# EAGLE design iobbq_main (EAGLE 7.2.0)
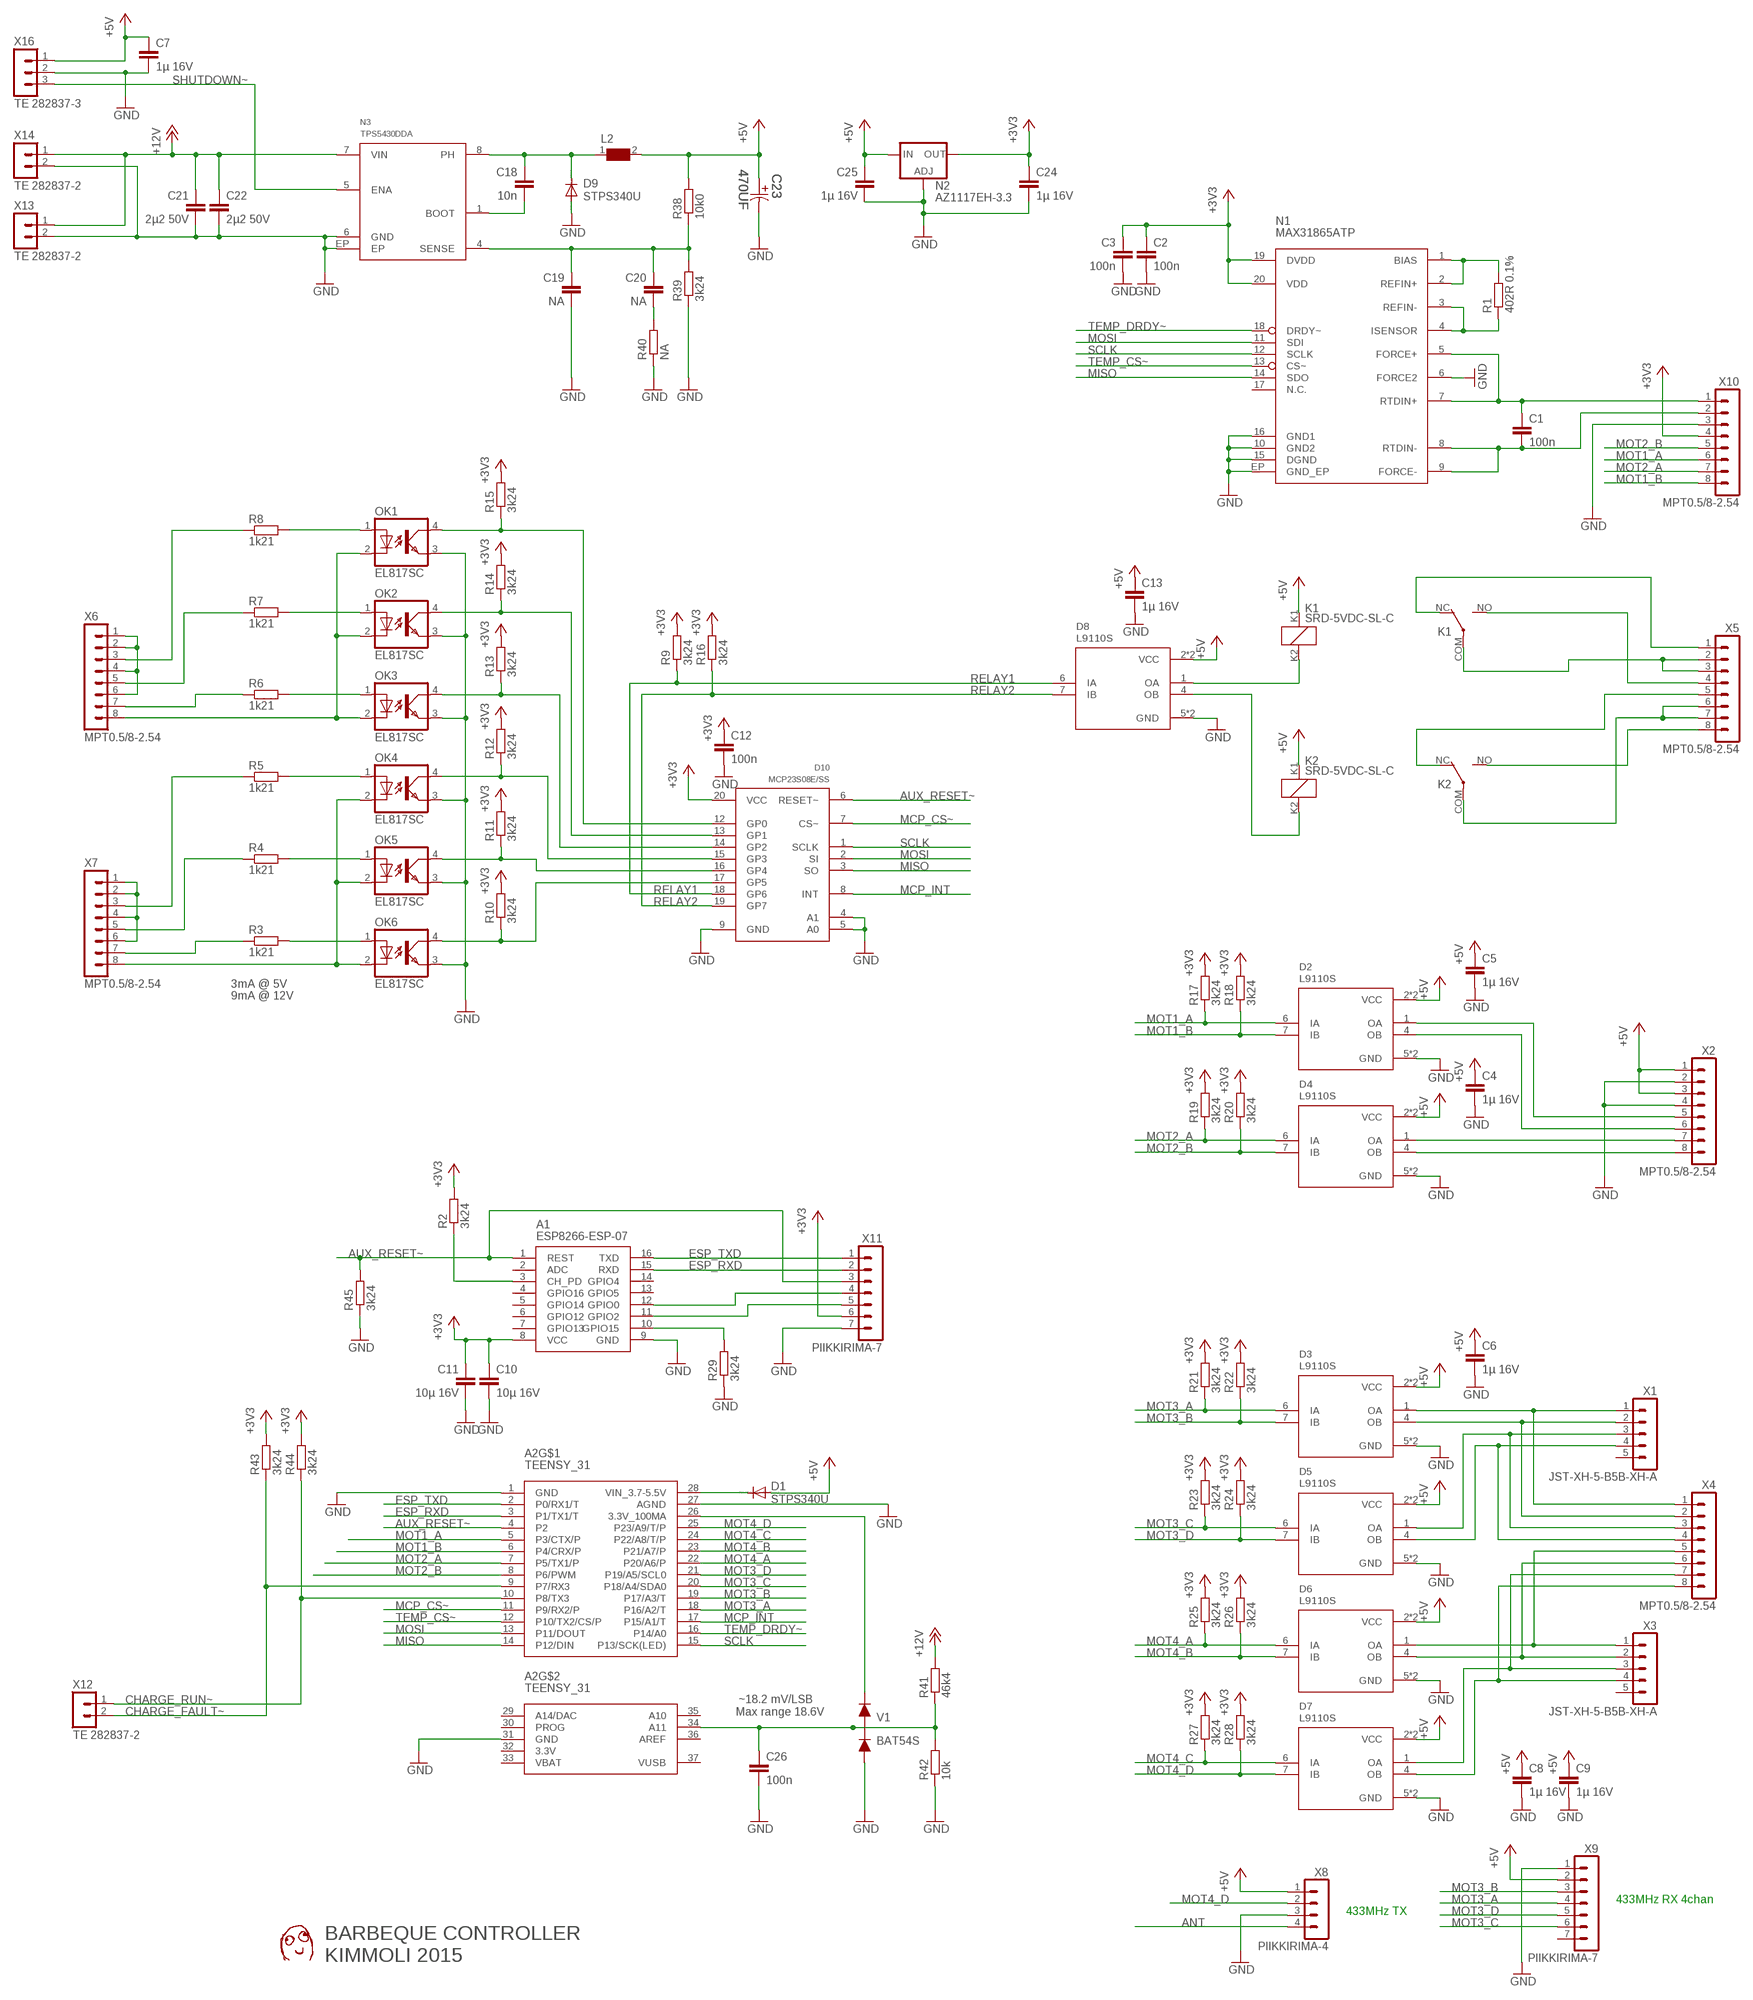
[diagram p0: schematic, sheet 1]

## Parts
A1  ESP8266-ESP-07  [ESP8266-ESP-07]
A2  TEENSY_31  [TEENSY_31_THONLY]
C1  100n  CAP0603  [C0603]
C2  100n  CAP0603  [C0603]
C3  100n  CAP0603  [C0603]
C4  1µ 16V  CAP0805  [C0805]
C5  1µ 16V  CAP0805  [C0805]
C6  1µ 16V  CAP0805  [C0805]
C7  1µ 16V  CAP0805  [C0805]
C8  1µ 16V  CAP0805  [C0805]
C9  1µ 16V  CAP0805  [C0805]
C10  10µ 16V  CAP0805  [C0805]
C11  10µ 16V  CAP0805  [C0805]
C12  100n  CAP0603  [C0603]
C13  1µ 16V  CAP0805  [C0805]
C18  10n  CAP0805  [C0805]
C19  NA  CAP0603  [C0603]
C20  NA  CAP0603  [C0603]
C21  2µ2 50V  CAP0805  [C0805]
C22  2µ2 50V  CAP0805  [C0805]
C23  470UF  EEV-FK1V471Q-CASE-H13  [CAPAE1350X1400N]
C24  1µ 16V  CAP0805  [C0805]
C25  1µ 16V  CAP0805  [C0805]
C26  100n  CAP0603  [C0603]
D1  STPS340U  DIODE-SMB  [SMB]
D2  L9110S  [SOIC8-N_MC]
D3  L9110S  [SOIC8-N_MC]
D4  L9110S  [SOIC8-N_MC]
D5  L9110S  [SOIC8-N_MC]
D6  L9110S  [SOIC8-N_MC]
D7  L9110S  [SOIC8-N_MC]
D8  L9110S  [SOIC8-N_MC]
D9  STPS340U  DIODE-SMB  [SMB]
D10  MCP23S08E/SS  [SSOP-20]
K1  SRD-5VDC-SL-C  [SRD-SL-C]
K2  SRD-5VDC-SL-C  [SRD-SL-C]
L2  WE-PD-7447709220_1260/1245/1280/1210  [WE-PD_1260/1245/1280/1210]
N1  MAX31865ATP  [TQFN-20]
N2  AZ1117EH-3.3  LD117AS33TR  [SOT223]
N3  TPS5430DDA  [SOIC8-N-EP]
OK1  EL817SC  SFH6186-2  [SMD4-7]
OK2  EL817SC  SFH6186-2  [SMD4-7]
OK3  EL817SC  SFH6186-2  [SMD4-7]
OK4  EL817SC  SFH6186-2  [SMD4-7]
OK5  EL817SC  SFH6186-2  [SMD4-7]
OK6  EL817SC  SFH6186-2  [SMD4-7]
R1  402R 0.1%  RES0603  [R0603]
R2  3k24  RES0603  [R0603]
R3  1k21  RES0805  [R0805]
R4  1k21  RES0805  [R0805]
R5  1k21  RES0805  [R0805]
R6  1k21  RES0805  [R0805]
R7  1k21  RES0805  [R0805]
R8  1k21  RES0805  [R0805]
R9  3k24  RES0603  [R0603]
R10  3k24  RES0603  [R0603]
R11  3k24  RES0603  [R0603]
R12  3k24  RES0603  [R0603]
R13  3k24  RES0603  [R0603]
R14  3k24  RES0603  [R0603]
R15  3k24  RES0603  [R0603]
R16  3k24  RES0603  [R0603]
R17  3k24  RES0603  [R0603]
R18  3k24  RES0603  [R0603]
R19  3k24  RES0603  [R0603]
R20  3k24  RES0603  [R0603]
R21  3k24  RES0603  [R0603]
R22  3k24  RES0603  [R0603]
R23  3k24  RES0603  [R0603]
R24  3k24  RES0603  [R0603]
R25  3k24  RES0603  [R0603]
R26  3k24  RES0603  [R0603]
R27  3k24  RES0603  [R0603]
R28  3k24  RES0603  [R0603]
R29  3k24  RES0603  [R0603]
R38  10k0  RES0603  [R0603]
R39  3k24  RES0603  [R0603]
R40  NA  RES0603  [R0603]
R41  46k4  RES0603  [R0603]
R42  10k  RES0603  [R0603]
R43  3k24  RES0603  [R0603]
R44  3k24  RES0603  [R0603]
R45  3k24  RES0603  [R0603]
U$3  DAFUG  [DAFUG]
V1  BAT54S  [SOT23]
X1  JST-XH-5-B5B-XH-A  [JST-XH-5]
X2  MPT0.5/8-2.54  [MPT0.5/8-2.54]
X3  JST-XH-5-B5B-XH-A  [JST-XH-5]
X4  MPT0.5/8-2.54  [MPT0.5/8-2.54]
X5  MPT0.5/8-2.54  [MPT0.5/8-2.54]
X6  MPT0.5/8-2.54  [MPT0.5/8-2.54]
X7  MPT0.5/8-2.54  [MPT0.5/8-2.54]
X8  PIIKKIRIMA-4  [PIIKKIRIMA-4]
X9  PIIKKIRIMA-7  [PIIKKIRIMA-7]
X10  MPT0.5/8-2.54  [MPT0.5/8-2.54]
X11  PIIKKIRIMA-7  [PIIKKIRIMA-7]
X12  TE 282837-2  TE_RUUVILIITIN2  [TE_RUUVILIITIN2]
X13  TE 282837-2  TE_RUUVILIITIN2  [TE_RUUVILIITIN2]
X14  TE 282837-2  TE_RUUVILIITIN2  [TE_RUUVILIITIN2]
X16  TE 282837-3  TE_RUUVILIITIN3  [TE_RUUVILIITIN3]

## Nets
+3V3: A1.8(VCC) C2.1 C3.1 C10.1 C11.1 C12.1 C24.1 D10.20(VCC) N1.19(DVDD) N1.20(VDD) N2.4(OUT) R2.2 R9.2 R10.2 R11.2 R12.2 R13.2 R14.2 R15.2 R16.2 R17.2 R18.2 R19.2 R20.2 R21.2 R22.2 R23.2 R24.2 R25.2 R26.2 R27.2 R28.2 R43.2 R44.2 X10.4 X11.6
+5V: C4.1 C5.1 C6.1 C7.1 C8.1 C9.1 C13.1 C23.1 C25.1 D1.A D2.2(VCC) D2.3(VCC) D3.2(VCC) D3.3(VCC) D4.2(VCC) D4.3(VCC) D5.2(VCC) D5.3(VCC) D6.2(VCC) D6.3(VCC) D7.2(VCC) D7.3(VCC) D8.2(VCC) D8.3(VCC) K1.K1 K2.K1 L2.2 N2.3(IN) R38.2 X2.1 X2.3 X8.1 X9.2 X16.1
+12V: C21.1 C22.1 N3.7(VIN) R41.2 X13.1 X14.1
ANT: X8.4
AUX_RESET~: A1.1(REST) A2.4(P2) D10.6(RESET~) R45.2 X11.3
CHARGE_FAULT~: A2.9(P7/RX3) R43.1 X12.2
CHARGE_RUN~: A2.10(P8/TX3) R44.1 X12.1
ESP_RXD: A1.15(RXD) A2.3(P1/TX1/T) X11.2
ESP_TXD: A1.16(TXD) A2.2(P0/RX1/T) X11.1
GND: A1.9(GND) A2.1(GND) A2.27(AGND) A2.31(GND) C2.2 C3.2 C4.2 C5.2 C6.2 C7.2 C8.2 C9.2 C10.2 C11.2 C12.2 C13.2 C19.2 C21.2 C22.2 C23.2 C24.2 C25.2 C26.2 D2.5(GND) D2.8(GND) D3.5(GND) D3.8(GND) D4.5(GND) D4.8(GND) D5.5(GND) D5.8(GND) D6.5(GND) D6.8(GND) D7.5(GND) D7.8(GND) D8.5(GND) D8.8(GND) D9.A D10.4(A1) D10.5(A0) D10.9(GND) N1.6(FORCE2) N1.10(GND2) N1.15(DGND) N1.16(GND1) N1.EP(GND_EP) N2.1(ADJ) N3.6(GND) N3.EP OK1.3(EMIT) OK2.3(EMIT) OK3.3(EMIT) OK4.3(EMIT) OK5.3(EMIT) OK6.3(EMIT) R29.1 R39.1 R40.1 R42.1 R45.1 V1.1 X2.2 X2.4 X8.3 X9.1 X10.3 X11.7 X13.2 X14.2 X16.2
MCP_CS~: A2.11(P9/RX2/P) D10.7(CS~)
MCP_INT: A2.17(P15/A1/T) D10.8(INT)
MISO: A2.14(P12/DIN) D10.3(SO) N1.14(SDO)
MOSI: A2.13(P11/DOUT) D10.2(SI) N1.11(SDI)
MOT1_A: A2.5(P3/CTX/P) D2.6(IA) R17.1 X10.6
MOT1_B: A2.6(P4/CRX/P) D2.7(IB) R18.1 X10.8
MOT2_A: A2.7(P5/TX1/P) D4.6(IA) R19.1 X10.7
MOT2_B: A2.8(P6/PWM) D4.7(IB) R20.1 X10.5
MOT3_A: A2.18(P16/A2/T) D3.6(IA) R21.1 X9.4
MOT3_B: A2.19(P17/A3/T) D3.7(IB) R22.1 X9.3
MOT3_C: A2.20(P18/A4/SDA0) D5.6(IA) R23.1 X9.6
MOT3_D: A2.21(P19/A5/SCL0) D5.7(IB) R24.1 X9.5
MOT4_A: A2.22(P20/A6/P) D6.6(IA) R25.1
MOT4_B: A2.23(P21/A7/P) D6.7(IB) R26.1
MOT4_C: A2.24(P22/A8/T/P) D7.6(IA) R27.1
MOT4_D: A2.25(P23/A9/T/P) D7.7(IB) R28.1 X8.2
N$1: OK1.2(C) OK2.2(C) OK3.2(C) X6.8
N$2: C1.2 N1.8(RTDIN-) N1.9(FORCE-) X10.2
N$3: D3.1(OA) X1.1 X4.1
N$4: D3.4(OB) X1.2 X4.2
N$5: D5.1(OA) X1.3 X4.3
N$6: D5.4(OB) X1.4 X4.4
N$7: D6.1(OA) X3.1 X4.5
N$8: R6.1 X6.7
N$9: D4.4(OB) X2.8
N$10: D6.4(OB) X3.2 X4.6
N$11: D4.1(OA) X2.7
N$12: D2.4(OB) X2.6
N$13: D2.1(OA) X2.5
N$14: D7.1(OA) X3.3 X4.7
N$15: D7.4(OB) X3.4 X4.8
N$16: D8.4(OB) K2.K2
N$17: A1.10(GPIO15) R29.2
N$18: D8.1(OA) K1.K2
N$24: OK4.2(C) OK5.2(C) OK6.2(C) X7.8
N$25: A1.3(CH_PD) R2.1
N$26: D10.17(GP5) OK6.4(COL) R10.1
N$27: D10.16(GP4) OK5.4(COL) R11.1
N$28: C1.1 N1.5(FORCE+) N1.7(RTDIN+) X10.1
N$29: D10.15(GP3) OK4.4(COL) R12.1
N$30: N1.3(REFIN-) N1.4(ISENSOR) R1.1
N$31: N1.1(BIAS) N1.2(REFIN+) R1.2
N$32: D10.14(GP2) OK3.4(COL) R13.1
N$33: D10.13(GP1) OK2.4(COL) R14.1
N$34: D10.12(GP0) OK1.4(COL) R15.1
N$35: R7.1 X6.5
N$36: OK1.1(A) R8.2
N$37: OK2.1(A) R7.2
N$38: OK3.1(A) R6.2
N$39: OK4.1(A) R5.2
N$40: OK5.1(A) R4.2
N$41: OK6.1(A) R3.2
N$42: R8.1 X6.3
N$43: C18.1 D9.C L2.1 N3.8(PH)
N$44: R3.1 X7.7
N$45: R4.1 X7.5
N$46: X6.1 X6.2 X6.4 X6.6
N$47: R5.1 X7.3
N$48: X7.1 X7.2 X7.4 X7.6
N$50: A2.28(VIN_3.7-5.5V) D1.C
N$55: A1.12(GPIO0) X11.4
N$56: A1.11(GPIO2) X11.5
N$58: C18.2 N3.1(BOOT)
N$60: C19.1 C20.1 N3.4(SENSE) R38.1 R39.2
N$62: C20.2 R40.2
N$72: A2.34(A11) C26.1 R41.1 R42.2 V1.3
N$73: A2.26(3.3V_100MA) V1.2
RELAY1: D8.6(IA) D10.18(GP6) R9.1
RELAY2: D8.7(IB) D10.19(GP7) R16.1
RLY1COM [rele]: K1.COM(P) X5.2 X5.3
RLY1NC [rele]: K1.NC(O) X5.1
RLY1NO [rele]: K1.NO(S) X5.4
RLY2COM [rele]: K2.COM(P) X5.6 X5.7
RLY2NC [rele]: K2.NC(O) X5.5
RLY2NO [rele]: K2.NO(S) X5.8
SCLK: A2.15(P13/SCK(LED)) D10.1(SCLK) N1.12(SCLK)
SHUTDOWN~: N3.5(ENA) X16.3
TEMP_CS~: A2.12(P10/TX2/CS/P) N1.13(CS~)
TEMP_DRDY~: A2.16(P14/A0) N1.18(DRDY~)
Unconnected: A1.2(ADC) A1.4(GPIO16) A1.5(GPIO14) A1.6(GPIO12) A1.7(GPIO13) A1.13(GPIO5) A1.14(GPIO4) A2.29(A14/DAC) A2.30(PROG) A2.32(3.3V) A2.33(VBAT) A2.35(A10) A2.36(AREF) A2.37(VUSB) N1.17(N.C.) X1.5 X3.5 X9.7

## Notes on the sheet
- 3mA @ 5V
- 9mA @ 12V
- ~18.2 mV/LSB
  Max range 18.6V
- 433MHz RX 4chan
- 433MHz TX
- BARBEQUE CONTROLLER
  KIMMOLI 2015

## Library data of the parts
A1 = OMAT_IC:ESP8266-ESP-07
A2 = OMAT_IC:TEENSY_31
C1-C13 C18-C22 C24-C26 = OMAT_IC:CAP
C23 = EKE:EEV-: Aluminum Electrolytic Capacitors,Surface Mount Type; MPN: EEVFK1V471Q; OC_FARNELL: 2282105; OC_NEWARK: 53W3911; SUPPLIER: PANASONIC; TOLERANCE: ±20 %; VOLTAGERATING: 35V
D1 D9 = diode:DIODE-: DIODE
D2-D8 = OMAT_IC:L9110S
D10 = OMAT_IC:MCP23S08
K1 K2 = OMAT_IC:SRD-5VDC-SL-C
L2 = WE-PD:WE-PD: SMD-Shielded Power Inductors WE-PD - Magnetically shielded version which results in a low leakage field - High storage capacity - Low self-losses - Highest possible current loading for SMD-Inducors -- Switching regulators with low operating voltages (computer, laptop, mobile phones, pagers) -- Integrated DC/DC-converter -- Is recommended for the application with switching regulators from National Semiconductor, Linear Technology, Texas Instruments and Fairchild Semiconductor, ect. -- Graphic cards -- Plastic base: Because of the one piece construction these are more suitable for high vibration or shock applications; MPN: 7447709220; OC_FARNELL: 1635945; OC_NEWARK: 08P2775; PACKAGE: 1210; SUPPLIER: Wuerth Elektronik
N1 = OMAT_IC:MAX31865
N2 = EKE:LD117A?*: Low drop fixed and adjustable positive voltage regulators 1 A Source: http://www.st.com/stonline/products/literature/ds/7194/ld1117axx.pdf
N3 = OMAT_IC:TPS5430
OK1-OK6 = optocoupler:SFH618?*: Optocoupler, Phototransistor Output, Low Input Current Source: Data sheet <http://www.vishay.com/docs/83673/sfh618.pdf>; MF: VISHAY/TELEFUNKEN; MPN: SFH6186-2; OC_FARNELL: 1469583; OC_NEWARK: 58K2210
R1-R29 R38-R45 = OMAT_IC:RES
U$3 = dafug:DAFUG
V1 = OMAT_IC:BAT54S
X1 X3 = OMAT_IC:JST-XH-5
X2 X4-X7 X10 = OMAT_IC:MPT0.5/8-2.54
X8 = OMAT_IC:PIIKKIRIMA-4
X9 X11 = OMAT_IC:PIIKKIRIMA-7
X12-X14 = OMAT_IC:TE_RUUVILIITIN2
X16 = OMAT_IC:TE_RUUVILIITIN3

## Net classes
1 rele: clearance 3 mm to class 0

## Board
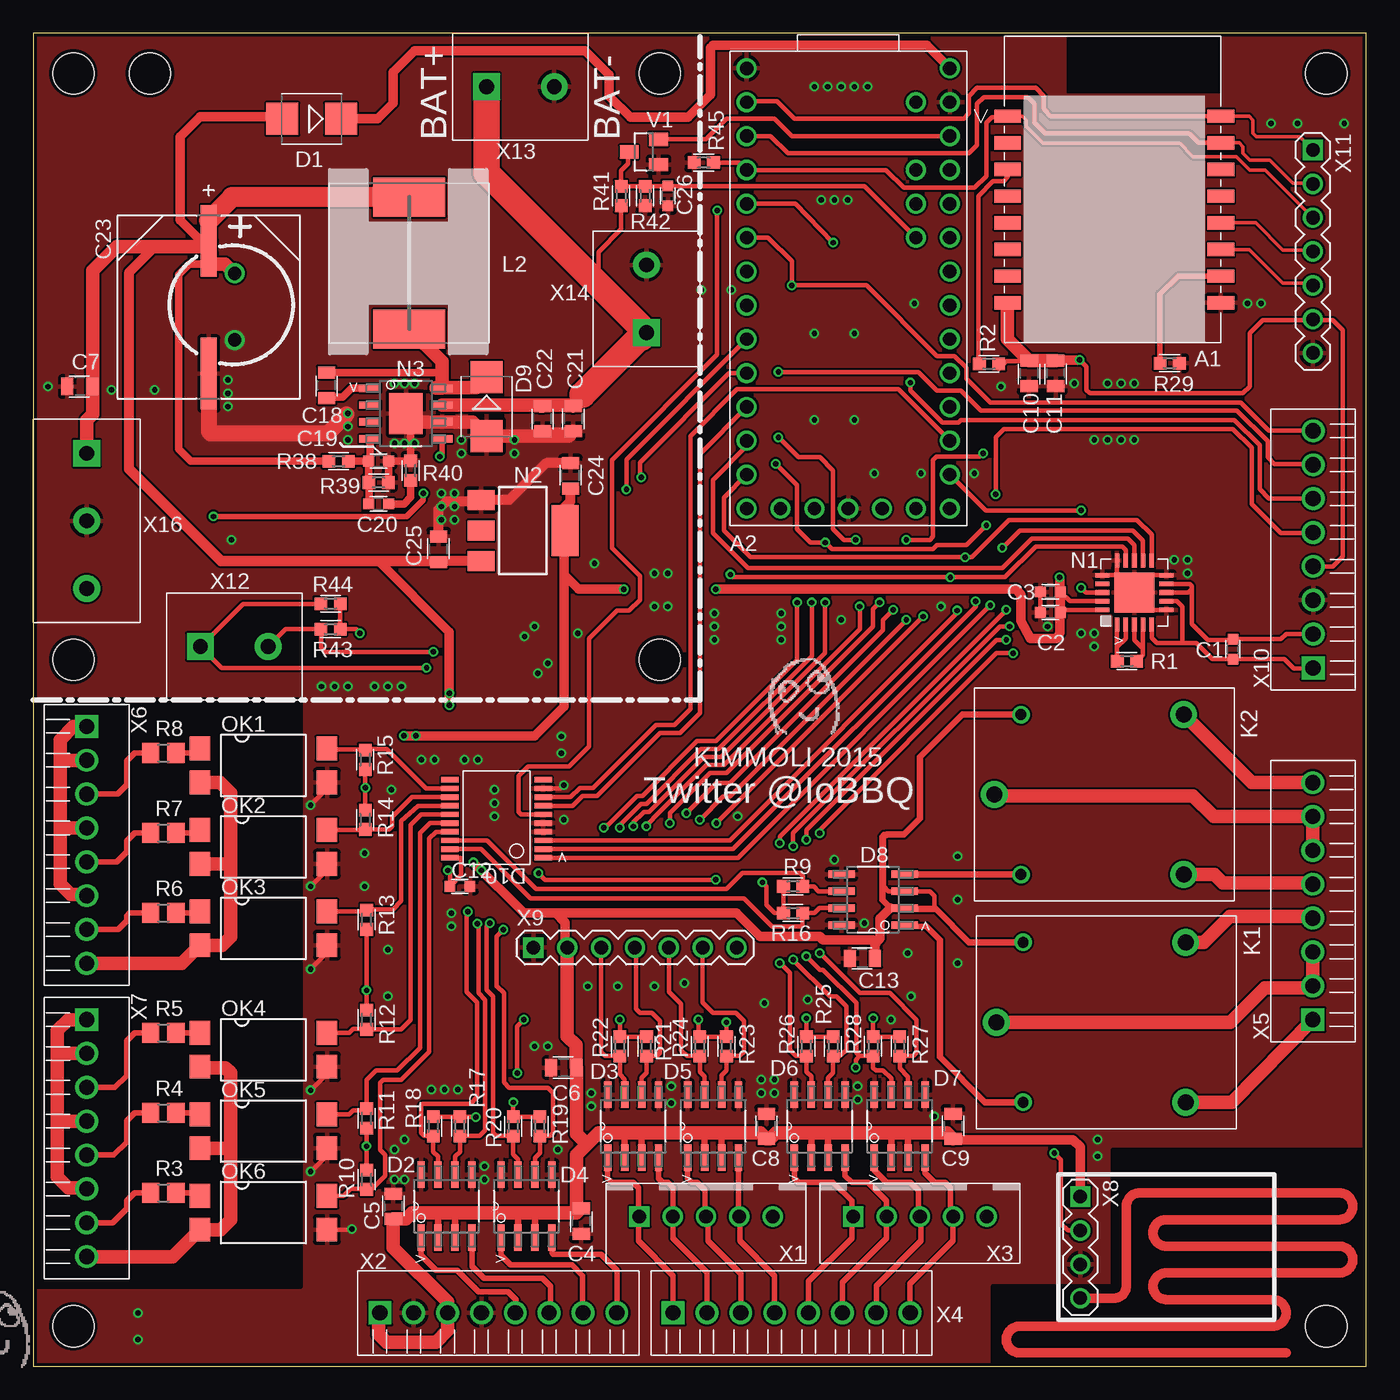
[diagram p1: board, top side]
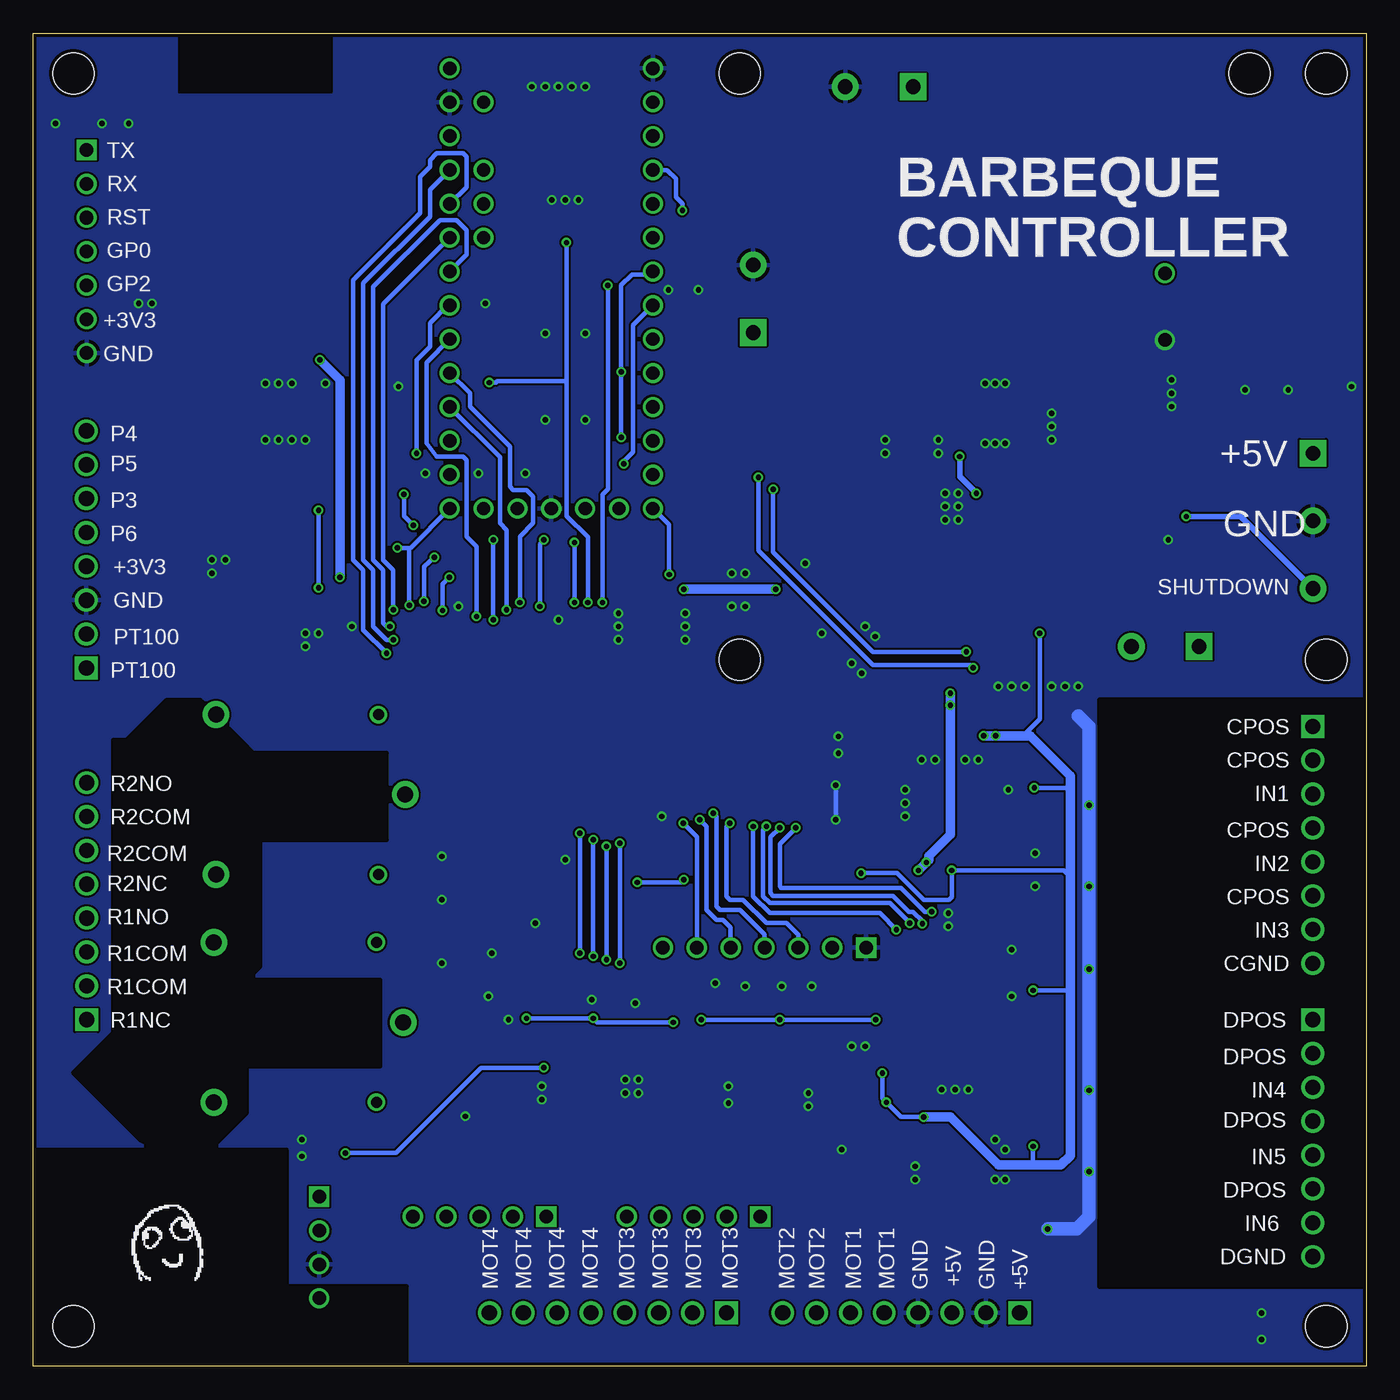
[diagram p2: board, bottom side, seen from below]

Size 100 x 100 mm. Coordinates in mm from the lower left corner, seen from the top.
Outline: 0,0 100,0 100,100 0,100 0,0
Copper layers (1*16): Top 0.035mm / dielectric 1.5mm / Bottom 0.035mm
Design rules "ITEADstudio_DRC": minimum track width 6mil, minimum drill 12mil, track to track 6mil, track to pad 6mil, pad to pad 6mil, via to via 6mil, smd to smd 0mil, copper to edge 10mil, drill to drill 10mil, minimum pad ring 10mil, minimum via ring 6mil, stop-mask expansion 2mil, vias tented up to drill 100mil, thermal gap 10mil
Holes 3.1 mm at 3,3 3,97 47,97 3,53 47,53 97,3 97,97 8.75,97
tRestrict: area 0,6 to 20,50; area 72,0 to 100,16.2
bRestrict: area 0,6 to 20,50; area 73.5,16.5 to 97,50; area 72,0 to 100,16.2

### Footprints (pad centres in the part's own frame; a part is rotated, then mirrored left to right if it is on the bottom)
ESP8266-ESP-07 = smd 2 x 1: 1 -8,0; 2 -8,-2; 3 -8,-4; 4 -8,-6; 5 -8,-8; 6 -8,-10; 7 -8,-12; 8 -8,-14; 9 8,-14; 10 8,-12; 11 8,-10; 12 8,-8; 13 8,-6; 14 8,-4; 15 8,-2; 16 8,0
TEENSY_31_THONLY = drill 1: 1 0,0; 2 0,-2.54; 3 0,-5.08; 4 0,-7.62; 5 0,-10.16; 6 0,-12.7; 7 0,-15.24; 8 0,-17.78; 9 0,-20.32; 10 0,-22.86; 11 0,-25.4; 12 0,-27.94; 13 0,-30.48; 14 0,-33.02; 15 15.24,-33.02; 16 15.24,-30.48; 17 15.24,-27.94; 18 15.24,-25.4; 19 15.24,-22.86; 20 15.24,-20.32; 21 15.24,-17.78; 22 15.24,-15.24; 23 15.24,-12.7; 24 15.24,-10.16; 25 15.24,-7.62; 26 15.24,-5.08; 27 15.24,-2.54; 28 15.24,0; 29 12.7,-33.02; 30 10.16,-33.02; 31 7.62,-33.02; 32 5.08,-33.02; 33 2.54,-33.02; 34 12.7,-12.7; 35 12.7,-10.16; 36 12.7,-7.62; 37 12.7,-2.54
C0603 = smd 0.8 x 0.8: 1 -0.75,0; 2 0.75,0
C0805 = smd 0.9 x 1.3: 1 -0.95,0; 2 0.95,0
CAPAE1350X1400N = smd 5.359 x 1.194: 1 -4.978,0; 2 4.978,0
SMB = smd 2.4 x 2.4: A 2.2,0; C -2.2,0
SOIC8-N_MC = smd 1.981 x 0.559: 1 -2.362,1.905; 2 -2.362,0.635; 3 -2.362,-0.635; 4 -2.362,-1.905; 5 2.362,-1.905; 6 2.362,-0.635; 7 2.362,0.635; 8 2.362,1.905
SSOP-20 = smd 1.3 x 0.4: 1 -3.5,0; 2 -3.5,-0.65; 3 -3.5,-1.3; 4 -3.5,-1.95; 5 -3.5,-2.6; 6 -3.5,-3.25; 7 -3.5,-3.9; 8 -3.5,-4.55; 9 -3.5,-5.2; 10 -3.5,-5.85; 11 3.5,-5.85; 12 3.5,-5.2; 13 3.5,-4.55; 14 3.5,-3.9; 15 3.5,-3.25; 16 3.5,-2.6; 17 3.5,-1.95; 18 3.5,-1.3; 19 3.5,-0.65; 20 3.5,0
SRD-SL-C = drill 1.2 pad 2: COM 0,0; NC 14.2,-6; NO 14.2,6 | drill 0.8: K1 2,6; K2 2,-6
WE-PD_1260/1245/1280/1210 = smd 2.9 x 5.4: 1 -4.95,0; 2 4.95,0
TQFN-20 = smd 1.05 x 0.35: 1 -2.39,1.3; 2 -2.39,0.65; 3 -2.39,0; 4 -2.39,-0.65; 5 -2.39,-1.3; 11 2.39,-1.3; 12 2.39,-0.65; 13 2.39,0; 14 2.39,0.65; 15 2.39,1.3 | smd 0.35 x 1.05: 6 -1.3,-2.39; 7 -0.65,-2.39; 8 0,-2.39; 9 0.65,-2.39; 10 1.3,-2.39; 16 1.3,2.39; 17 0.65,2.39; 18 0,2.39; 19 -0.65,2.39; 20 -1.3,2.39 | smd 3 x 3: EP 0,0
SOT223 = smd 1.5 x 2: 1 -2.3,-3.15; 2 0,-3.15; 3 2.3,-3.15 | smd 3.8 x 2: 4 0,3.15
SOIC8-N-EP = smd 1.6 x 0.559: 1 -2.7,1.905; 2 -2.7,0.635; 3 -2.7,-0.635; 4 -2.7,-1.905; 5 2.7,-1.905; 6 2.7,-0.635; 7 2.7,0.635; 8 2.7,1.905 | smd 2.5 x 3.1: EP 0,0
SMD4-7 = smd 1.78 x 1.55: 1 -1.27,-4.77; 2 1.27,-4.77; 3 1.27,4.77; 4 -1.27,4.77
R0603 = smd 0.95 x 0.95: 1 -0.725,0; 2 0.725,0
R0805 = smd 1.3 x 1.5: 1 -0.95,0; 2 0.95,0
SOT23 = smd 1 x 1.4: 1 -0.95,-1.1; 2 0.95,-1.1; 3 0,1.1
JST-XH-5 = drill 1.016 square: 1 10,0 | drill 1.016: 2 7.5,0; 3 5,0; 4 2.5,0; 5 0,0
MPT0.5/8-2.54 = drill 1.143 square: 1 0,0 | drill 1.143: 2 2.54,0; 3 5.08,0; 4 7.62,0; 5 10.16,0; 6 12.7,0; 7 15.24,0; 8 17.78,0
PIIKKIRIMA-4 = drill 1.016 square: 1 0,0 | drill 1.016: 2 2.54,0; 3 5.08,0; 4 7.62,0
PIIKKIRIMA-7 = drill 1.016 square: 1 0,0 | drill 1.016: 2 2.54,0; 3 5.08,0; 4 7.62,0; 5 10.16,0; 6 12.7,0; 7 15.24,0
TE_RUUVILIITIN2 = drill 1.1 pad 2 square: 1 0,0 | drill 1.1 pad 2: 2 5.08,0
TE_RUUVILIITIN3 = drill 1.1 pad 2 square: 1 0,0 | drill 1.1 pad 2: 2 5.08,0; 3 10.16,0

### Placement (x,y rotation side)
A1  81.09,93.78 0 top
A2  53.52,97.37 0 top
C1  90,53.8 90 top
C2  76.3,56.55 180 top
C3  76.3,58.1 180 top
C4  41.1,10.9 270 top
C5  27,12 90 top
C6  39.8,22.4 180 top
C7  3.5,73.5 180 top
C8  55,18 90 top
C9  69,18 90 top
C10  74.7,74.5 270 top
C11  76.7,74.5 270 top
C12  32,36 0 top
C13  62.2,30.6 180 top
C18  22,73.6 270 top
C19  25.9,67.9 0 top
C20  25.9,64.7 0 top
C21  40.5,71.1 270 top
C22  38.2,71.1 270 top
C23  13.16,79.46 270 top
C24  40.3,66.8 90 top
C25  30.4,61.3 90 top
C26  47.6,87.8 270 top
D1  20.88,93.58 180 top
D2  31,12 90 top
D3  45,18 90 top
D4  37,12 90 top
D5  51,18 90 top
D6  59,18 90 top
D7  65,18 90 top
D8  63,35 180 top
D9  34,72 270 top
D10  34.75,38.15 180 top
K1  72.25,25.8 0 top
K2  72.1,42.89 0 top
L2  28.2,82.76 90 top
N1  82.6,58.05 90 top
N2  36.74,62.69 270 top
N3  27.95,71.47 0 top
OK1  17.26,45.07 270 top
OK2  17.26,38.96 270 top
OK3  17.26,32.85 270 top
OK4  17.26,23.74 270 top
OK5  17.26,17.63 270 top
OK6  17.26,11.52 270 top
R1  82.05,52.9 180 top
R2  71.7,75.2 0 top
R3  9.75,13 0 top
R4  9.75,19 0 top
R5  9.75,25 0 top
R6  9.75,34 0 top
R7  9.75,40 0 top
R8  9.75,46 0 top
R9  57,36 180 top
R10  25,14 90 top
R11  25,18.6 270 top
R12  25,26 90 top
R13  25,33.5 270 top
R14  24.9,41 90 top
R15  24.9,45.5 270 top
R16  57,34 180 top
R17  32,18 90 top
R18  30,18 90 top
R19  38,18 90 top
R20  36,18 90 top
R21  46,24 90 top
R22  44,24 90 top
R23  52,24 90 top
R24  50,24 90 top
R25  60,24 90 top
R26  58,24 90 top
R27  65,24 90 top
R28  63,24 90 top
R29  85.25,75.25 180 top
R38  22.9,67.9 180 top
R39  25.9,66.3 180 top
R40  28.3,67.2 270 top
R41  44.1,87.8 270 top
R42  45.9,87.8 90 top
R43  22.3,55.3 0 top
R44  22.3,57.2 0 top
R45  50.3,90.3 0 top
U$1  [DAFUG]  89.75,9 0 bottom
U$2  [DAFUG]  58,50 0 top
U$3  -2.75,2.5 0 top
V1  45.8,91.1 90 top
X1  55.47,11.23 180 top
X2  26,4 0 top
X3  71.52,11.23 180 top
X4  48,4 0 top
X5  96,26 90 top
X6  4,48 270 top
X7  4,26 270 top
X8  78.55,12.72 270 top
X9  37.52,31.41 0 top
X10  96.02,52.39 90 top
X11  96,91.25 270 top
X12  12.54,54 0 top
X13  34,96 0 top
X14  46,77.54 90 top
X16  4,68.5 270 top

### Tracks (layer width: path | path; a pad name or v marks a point on that pad's centre or on a via)
+3V3  (via drill 0.4)
  Top 0.25: 95.95,78.5 X11.6
  Top 0.35: N1.20 77.25,56.75 C2.1 | N1.19 77.75,57.4 C3.1 | R44.2 R43.2 24.2,55.3 v24.5,55 | 39.8,62.6 N2.4 | R10.2 v25,16.5 R11.2 | R12.2 v25,28.2 R13.2 | R15.2 v24.9,43.4 R14.2 | v31.1,37.2 31.25,37.05 C12.1 32.1,36.85 32.1,38.1 32.05,38.15 D10.20 | v44,26 R22.2 R21.2 | v49.9,26 49.9,24.82 R24.2 R23.2 v52,25.8 | R9.2 R16.2 55.6,34 55,34.6 55,36 v54.7,36.3 | R25.2 R26.2 v58,26.1 | R27.2 R28.2 v63,26.1 | R2.2 72.42,74.83 73,75.4 74.65,75.4 C10.1 | R18.2 R17.2 33.17,18.73 v33.2,18.7 | v36,19.8 R20.2 R19.2 | v36.8,26 36.3,25.5 v36.3,22 | v51.2,36.5 38.4,36.5 v37.9,37 | v78.5,75.5 79,75 79,73.25 79.25,73 90.75,73 91.25,73.5 91.25,77.5 92.25,78.5 95.95,78.5 | X10.4 97.51,60.01 98.25,60.75 98.25,77.75 97.5,78.5 96.05,78.5 X11.6
  Top 0.7: 39.8,62.6 39.8,59.4 | 39.8,59.4 39.8,49.5 37.6,47.3 v27.8,47.3 | v51.2,58.3 73.7,58.3 74.1,57.9 74.1,55.9 74.8,54.6 76.8,54.6 77,55 77,56.5 C2.1 C3.1 77,58.15 v77,59.2 | v44.3,58.3 40.9,58.3 39.8,59.4 | v78.5,75.5 76.75,75.5 C11.1
  Top 0.75: N2.4 39.89,64.49 40.3,64.9 C24.1
  Top 1: A1.8 73.09,77.06 C10.1 C11.1
  Bottom 0.35: v25,16.5 25,15.3 24.8,15.1 | v25,28.2 22.3,28.2 22.2,28.1 | v24.9,43.4 22.3,43.4 22.2,43.3 | 22.2,36.7 22.7,37.2 v31.1,37.2 31.1,35.2 31.3,35 33.2,35 35.2,37 v37.9,37 | v49.9,26 v44,26 v36.8,26 | v63,26.1 v58,26.1 57.7,25.8 v52,25.8 | v24.5,55 24.5,48.55 25.75,47.3 | v33.2,18.7 34.9,18.7 v36,19.8 36.3,20.1 v36.3,22 | v54.7,36.3 51.4,36.3 v51.2,36.5
  Bottom 0.7: v33.2,18.7 31.2,18.7 27.6,15.1 24.8,15.1 22.9,15.1 22.2,15.8 22.2,28.1 22.2,36.7 22.2,43.3 22.2,44.3 25.2,47.3 25.75,47.3 v27.8,47.3 v28.7,47.3 | v51.2,58.3 v44.3,58.3 | v77,59.2 77,74 v78.5,75.5
+5V  (via drill 0.4, 1)
  Top 0.35: 65.43,34.3 D8.2 | 67.7,34.3 67.6,34.4 67.6,35.3 67.27,35.63 D8.3 64.17,35.63 63.8,36 63.8,39.8 | 63.8,39.8 63.8,39.85 | 65.2,34.4 64.3,34.4 | 63.7,39.7 63.8,39.8 | N2.3 25.81,60.39 25.8,60.4
  Top 0.5: K1.K1 70.2,31.8 67.7,34.3 65.43,34.3 | K2.K1 69.69,48.89 66.5,45.7 66.5,41.1 65.3,39.9 64.05,39.9 64,39.85 63.8,39.85 | 64.3,34.4 63.7,35 63.7,39.7 | D7.3 65.64,17.46 65.6,17.5 | D7.2 64.36,17.43 64.3,17.5 | D6.3 59.63,17.36 59.5,17.5 | D6.2 58.37,17.43 58.3,17.5 | D5.3 51.63,17.46 51.6,17.5 | D5.2 50.37,17.36 50.5,17.5 | D3.2 44.37,17.46 44.4,17.5 | D3.3 45.63,17.36 45.5,17.5 | D2.2 30.36,11.44 30.3,11.5 | D2.3 31.64,11.34 31.8,11.5 | D4.2 36.37,11.37 36.5,11.5 | D4.3 37.63,11.37 37.5,11.5
  Top 0.55: R38.2 11.8,67.9 10.9,68.8 10.9,81.9 11.7,82.7 12.92,82.7 C23.1
  Top 0.7: 17.67,87.74 17.7,87.71 | 25.8,60.4 25.9,60.4 31.2,55.1 v31.2,49.6 | v33,37.8 36.8,34 39.2,34 | 39.2,34 39.9,33.3 39.9,31.57 X9.2 | 64.3,34.4 63.5,33.6 63.5,32.1 63.15,31.75 | 63.2,30.55 C13.1 63.15,31.75 | 39.2,34 52.75,34 54.5,32.25 59,32.25 59.25,32 63,32 63.25,31.75 63.15,31.75 | X8.1 78.55,16.45 78,17 69.05,17 C9.1 | C23.1 13,84.28 13,84 11,86 11,92.25 12.5,93.75 18.51,93.75 D1.A
  Top 0.75: N2.3 30.44,60.39 C25.1 | 7.2,67.3 7.2,82.1 9.1,84 12.66,84 13.16,83.5
  Top 0.8: 30.44,60.39 14.11,60.39 7.2,67.3
  Top 1: 40.75,11.5 37.5,11.5 36.5,11.5 31.8,11.5 30.3,11.5 28.4,11.5 27.95,11.05 C5.1 27,8.9 31.08,4.82 X2.3 31.08,2.68 30.2,1.8 26.5,1.8 25.9,2.4 25.9,3.9 X2.1 | C9.1 68.55,17.5 65.6,17.5 64.3,17.5 59.5,17.5 58.3,17.5 55.7,17.5 55.25,17.05 C8.1 54.55,17.5 51.6,17.5 50.5,17.5 45.5,17.5 44.4,17.5 42.4,17.5 41.55,16.65 | 40.75,11.5 C4.1 | 40.75,11.5 40.75,15.85 41.55,16.65 | 41.55,16.65 40.75,17.45 C6.1 40.7,22.45 40.7,24.1 40.06,24.74 X9.2 | 13.16,84.25 12.91,84 6.25,84 4.45,82.2 C7.1 4.45,71.45 4,71 X16.1 | 12.92,82.7 14.4,82.7 v15.1,82
  Top 1.2: 13.16,83.5 13.16,84.25 C23.1 13.16,85.96
  Top 1.5: L2.2 17.7,87.71 14.91,87.71 13.16,85.96
  Bottom 0.7: v33.6,37.2 v33,37.8 32.8,38 32.8,38.3 31.2,39.9 v31.2,49.6 v31.2,50.5
+12V
  Top 0.35: R41.2 44.1,85.3 42.4,83.6 42.4,80.4 45.63,77.17
  Top 1: N3.7 38,72.11 | 38,72.11 40.5,72.11 C21.1 41.2,72.75 41.2,72.9 | 45.63,77.17 X14.1 | C22.1 38.05,72.05 38,72.11
  Top 2: X13.1 34,89.54 X14.1 | 45.63,77.17 45.47,77.17 41.2,72.9
ANT
  Top 0.7: X8.4 81.1,5.1 arc90 82,6 82,12 arc-90 83,13 98,13 arc-90 99,12 arc-90 98,11 85,11 arc90 84,10 arc90 85,9 98,9 arc-90 99,8 arc-90 98,7 85,7 arc90 84,6 arc90 85,5 93,5 arc-90 94,4 arc-90 93,3 74,3 arc90 73,2 arc90 74,1 94,1
AUX_RESET~  (via drill 0.4)
  Top 0.25: A1.1 74.22,93.78 74.5,93.5 74.5,93 75.75,91.75 86,91.75 87,90.75 90.25,90.75 91.25,89.75 92.42,89.75 X11.3
  Top 0.35: A1.1 72.78,93.78 72.7,93.7 71.9,93.7 71.5,93.3 71.5,89.3 70.6,88.4 65.3,88.4 63.95,89.75 A2.4 52.97,90.3 R45.2 | v51.3,86.7 51.3,75.9 43.4,68 43.4,61.4 45.5,59.3 45.5,57.5 44.7,56.7 43.8,56.7 41.7,54.6 41.7,46.5 40.2,45 37.1,45 36.4,44.3 36.4,41.6 36.6,41.4 D10.6
  Bottom 0.35: A2.4 52.45,89.75 51.8,89.1 51.8,87.7 51.3,87.2 v51.3,86.7
CHARGE_FAULT~  (via drill 0.4)
  Top 0.35: X12.2 18.92,55.3 R43.1 21.57,53.92 21.9,53.6 v30,53.6 | v44.5,65.8 44.5,68.03 A2.9
  Bottom 0.35: v30,53.6 37,53.6 44.5,61.1 v44.5,65.8
CHARGE_RUN~  (via drill 0.4)
  Top 0.35: R44.1 15.74,57.2 X12.1 14.14,52.4 v29.5,52.4 | A2.10 52.21,74.51 45.5,67.8 45.5,66.8 v45.6,66.7
  Bottom 0.35: v45.6,66.7 45.6,61.2 37,52.6 29.7,52.6 v29.5,52.4
ESP_RXD
  Top 0.25: A1.15 90.47,91.78 90.75,91.5 90.75,91 91.25,90.5 92.75,90.5 94.5,88.75 95.96,88.75 X11.2
  Top 0.35: A2.3 55.31,92.29 56.6,91 70.2,91 70.8,91.6 70.8,94.7 71.3,95.2 74.6,95.2 75.1,94.7 75.1,93.3 75.9,92.5 86.7,92.5 87.4,91.8 89.07,91.8 A1.15
ESP_TXD
  Top 0.25: A1.16 91.22,93.78 91.5,93.5 91.5,92.5 91.75,92.25 95,92.25 X11.1
  Top 0.35: A1.16 76.32,93.78 75.8,94.3 75.8,95.3 75.2,95.9 70.8,95.9 70.2,95.3 70.2,94 69.8,93.6 57.1,93.6 55.8,94.9 53.59,94.9 A2.2
GND  (via drill 0.4, 1)
  Top 0.35: N1.10 83.55,59.35 83.5,59.3 83.5,58.95 N1.EP | N1.6 83.9,56.75 N1.EP | N1.15 81.3,59.35 | N1.16 81.3,59.35 | 81.3,59.35 N1.EP | C2.2 C3.2 | OK6.3 23.85,10.25 v23.9,10.3 | OK1.3 22.03,43.23 21.93,43.23 v20.8,42.1 | OK5.3 22.03,15.83 v20.8,14.6 | OK4.3 22.03,21.93 v20.8,20.7 | OK3.3 22.03,31.03 v20.8,29.8 | OK2.3 22.03,37.23 v20.8,36 | D10.9 39.55,43.35 v39.8,43.6
  Top 0.55: N3.EP 28.59,70.83 28.3,70.55 R40.1 28.27,67.9 C19.2 26.65,66.33 R39.1 | C22.2 39.75,70.15 40.1,69.8
  Top 0.75: C25.2 30.4,64.3 31,64.9 33.5,64.9 N2.1 35.7,65 38.45,67.75 C24.2
  Top 1: 28.59,70.83 N3.6 32.97,70.83 D9.A 40.1,69.8 40.15,69.8 C21.2
  Top 1.2: C23.2 13.16,70.14 13.3,70 22.1,70 23.5,71.4 | 27.88,71.4 N3.EP
  Bottom 0.35: v39.8,41 v39.8,43.6
  Bottom 1: v23.9,10.3 21.7,10.3 20.8,11.2 v20.8,14.6 v20.8,20.7 v20.8,29.8 v20.8,36 v20.8,42.1 | 20.8,42 v20.8,42.1 | v20.8,42.1 20.8,48 21.6,48.8
  other vias: 76.1,55.5 85.6,60.5 86.6,60.5 86.6,59.5 78.6,55 79.6,55 79.6,54 56.1,56.5 56.1,55.5 56.1,54.5 51.1,56.5 51.1,55.5 51.1,54.5 46.6,57 47.6,57 46.6,59.5 47.6,59.5 23.6,71.5 23.6,70.5 23.6,69.5 32.1,68.5 36.1,68.5 36.1,69.5 32.1,69.5 14.6,72 14.6,73 14.6,74 21.6,51 22.6,51 23.6,51 25.6,51 26.6,51 27.6,51 30.6,63.5 30.6,64.5 30.6,65.5 31.6,65.5 31.6,64.5 31.6,63.5 58.6,96 59.6,96 60.6,96 61.6,96 62.6,96 92.85,93.25 94.85,93.25 98.35,93.25 59.1,87.5 60.1,87.5 61.1,87.5 58.6,77.5 61.6,77.5 58.6,71 61.6,71 78.1,73.75 80.6,73.75 81.6,73.75 82.6,73.75 82.6,69.5 81.6,69.5 80.6,69.5 79.6,69.5 72.6,73.5 70.6,67 66.6,67 63.1,67 60.1,38 55.6,20.5 54.6,20.5 54.6,21.5 55.6,21.5 61.85,21 61.85,20 67.6,18.75 47.85,19.75 47.85,21 41.85,19.5 41.85,20.5 39.35,16.25 33.85,15 33.85,14 27.1,14 27.85,14 79.85,17 79.85,15.75 7.85,2 7.85,4 24.85,36 24.85,38.5 26.85,43.25 26.6,27.75 26.6,31.25 34.6,41.25 34.6,42.25 34.6,43.25 31.35,34 31.35,33 39.6,46 39.6,47.25 29.1,45.5 30.1,45.5 32.35,45.5 33.35,45.5 65.6,31 69.35,30.25 69.35,35 69.35,38.25 58.1,27.5 65.85,27.75 64.35,26 54.85,27.25 48.85,28.75 46.6,28.5 43.85,28.5 41.6,28.5 38.6,24 37.6,24 52.85,41.25 68.1,57 60.6,56 27.1,73.75 27.85,73.75 28.6,73.75 29.85,20.75 30.85,20.75 31.85,20.75 27.1,16.25 27.85,17 62.35,33.25 91.1,79.75 92.1,79.75 66.1,79.75 52.35,80.75 50.1,80.75 42.1,60.25 37.6,55.5 36.85,54.75 38.6,52.75 40.85,55 37.85,52 9.1,73.25 5.85,73.25 14.85,62 1.1,73.5 27.1,69.25 27.85,69.25 28.6,69.25 15.1,77
  pour Top: 0,100 100,100 100,0 0,0
  pour Bottom: 0,100 100,100 100,0 0,0
MCP_CS~
  Top 0.35: D10.7 40.45,42.05 41.2,42.8 42.3,42.8 47,47.5 48.5,47.5 50,49 50,68.45 A2.11
MCP_INT
  Top 0.35: D10.8 40.3,42.7 41,43.4 42,43.4 46.7,48.1 48.1,48.1 49.3,49.3 49.3,69.8 52.8,73.3 64.89,73.3 A2.17
MISO  (via drill 0.4)
  Top 0.35: N1.14 81.95,61.25 81.7,61.5 75.2,61.5 72.9,59.2 v68.8,59.2 52.5,59.2 v52.3,59.4 | D10.3 52.25,39.45 69.3,56.5 v69.3,56.7
  Bottom 0.35: v52.3,59.4 52.3,63.13 A2.14 | v69.3,56.7 69.3,58.7 v68.8,59.2
MOSI  (via drill 0.4)
  Top 0.35: N1.11 83.9,62.4 82.8,63.5 73.2,63.5 70.4,60.7 v69.9,60.7 53.8,60.7 51.8,62.7 51.8,65.17 A2.13 | D10.2 52.5,38.8 70.7,57 v70.7,57.4
  Bottom 0.35: v70.7,57.4 70.7,60 v69.9,60.7
MOT1_A  (via drill 0.4)
  Top 0.35: D2.6 31.64,15.73 32,16.1 R17.1 33.48,17.27 33.9,17.7 33.9,27.5 33.4,28 33.4,33.1 v33.3,33.2 | v44,40.4 44,40.6 45.6,42.2 46,42.2 50.1,46.3 51.4,46.3 58.4,53.3 v58.4,57.3 | A2.5 57.19,87.21 v60,84.3 | v65.8,73.8 65.8,73.2 68.2,70.8 69.4,70.8 69.6,71 90.1,71 92,69.1 92,65.8 92.7,65.1 X10.6
  Bottom 0.35: v33.3,33.2 33.3,33.4 34,34.1 34.3,34.1 35.5,35.3 44.5,35.3 44.7,35.5 44.7,39.7 v44,40.4 | v60,84.3 60,73.9 | 60,73.9 60,63.8 58.4,62.2 v58.4,57.3 | v65.8,73.8 65.3,73.8 65.2,73.9 60,73.9
MOT1_B  (via drill 0.4)
  Top 0.35: D2.7 30.36,15.73 30,16.1 R18.1 29.32,17.27 29.1,17.5 29.1,19.6 29.2,19.7 32.8,19.7 33.3,20.2 33.3,27.3 32.5,28.1 32.5,34 v32.6,34.1 | v42.8,40.4 42.9,40.4 45.3,42.8 45.7,42.8 49.8,46.9 51.2,46.9 57.3,53 v57.3,57.3 | A2.6 55.13,84.67 56.9,82.9 v56.9,81.1 62.5,81.1 67.8,75.8 69.1,75.8 70,74.9 70,74.1 71.8,72.3 90.6,72.3 92.7,70.2 95.99,70.2 X10.8
  Bottom 0.35: v32.6,34.1 33.1,34.1 34.9,35.9 43.9,35.9 44,36 44,39.2 v42.8,40.4 | v56.9,81.1 56.9,65.8 57.3,65.4 v57.3,57.3
MOT2_A  (via drill 0.4)
  Top 0.35: D4.6 37.63,15.63 38,16 R19.1 38.77,17.27 39,17.5 39,20.5 38.6,20.9 35.7,20.9 35.3,21.3 35.3,28 34.8,28.5 34.75,28.5 34.75,32.25 v35.25,32.75 | v46,40.5 46,40.55 46.65,41.25 50.5,45.1 51.8,45.1 62,55.3 v62,57 | v61.7,62 60.8,62 60,62.8 60,67.2 59,68.2 57.4,68.2 v55.9,69.7 | v55.9,74.6 66.4,74.6 67.8,73.2 69.6,73.2 71.1,71.7 90.3,71.7 92.6,69.4 92.6,68.2 93.1,67.7 95.95,67.7 X10.7
  Bottom 0.35: v35.25,32.75 36.5,34 44.75,34 46,35.25 v46,40.5 | v62,57 62,61.7 v61.7,62 | v55.9,69.7 v55.9,74.6 55.9,81.1 55.1,81.9 53.75,81.9 A2.7
MOT2_B  (via drill 0.4)
  Top 0.35: D4.7 36.37,15.54 36,15.9 R20.1 34.73,17.27 34.5,17.5 34.5,27.75 34,28.25 34,33 v34.25,33.25 | v45,40.5 45,40.8 45.8,41.6 46.2,41.6 50.3,45.7 51.6,45.7 59.4,53.5 v59.4,57.3 | v55.7,67.7 57.3,66.1 57.3,62.8 58.3,61.8 v59.4,61.8 59.9,61.3 67.5,61.3 67.8,61.6 70,61.6 v71.5,63.1 | v72.2,65.4 72.2,69.7 72.8,70.3 90,70.3 91.4,68.9 91.4,64.7 93.6,62.5 95.97,62.5 X10.5
  Bottom 0.35: v34.25,33.25 35.75,34.75 44.75,34.75 45.25,35.25 45.25,40.25 v45,40.5 | v59.4,57.3 v59.4,61.8 | v55.7,67.7 55.7,67.9 55,68.6 55,78.11 A2.8 | v72.2,65.4 72.2,63.8 v71.5,63.1
MOT3_A  (via drill 0.4)
  Top 0.35: D3.6 45.63,21.64 46,22 R21.1 46.77,23.27 47,23.5 47,25.9 46.4,26.5 45.5,26.5 45.2,26.8 45.2,31.35 X9.4 | v49,41.5 51.25,43.75 52.25,43.75 63.75,55.25 63.75,56 v64.5,56.75
  Bottom 0.35: X9.4 45.14,32.39 47,34.25 48.5,34.25 48.75,34.5 48.75,41.25 v49,41.5 | v64.5,56.75 64.5,62.75 65,63.25 65,68.21 A2.18
MOT3_B  (via drill 0.4)
  Top 0.35: D3.7 44.37,21.54 44,21.9 R22.1 43.98,23.3 42.9,23.3 42.6,23.6 X9.3 | v47.75,40.75 47.75,41.5 50.75,44.5 52,44.5 63,55.5 63,56.8 v63.5,57.3
  Bottom 0.35: X9.3 42.6,32.35 43.5,33.25 45,33.25 46.75,35 47.75,35 48,35.25 48,40.5 v47.75,40.75 | v63.5,57.3 63.5,62.25 62.5,63.25 62.5,65.25 63,65.75 64,65.75 64.25,66 64.25,69 67.25,72 67.25,73 A2.19
MOT3_C  (via drill 0.4)
  Top 0.35: D5.6 51.63,21.84 52,22.2 R23.1 52.98,23.27 53.3,23.6 53.3,25.9 52.7,26.5 51,26.5 50.2,27.3 50.2,31.39 X9.6 | v51.25,40.75 v66.75,56.25
  Bottom 0.35: X9.6 50.22,39.72 v51.25,40.75 | v66.75,56.25 66.75,61.5 67.5,62.25 67.5,68 67.75,68.25 69.75,68.25 70.5,69.25 70.5,75.31 A2.20
MOT3_D  (via drill 0.4)
  Top 0.35: D5.7 50.37,21.73 50,22.1 R24.1 49.02,23.27 48.6,23.7 48.6,27.2 47.7,28.1 47.7,31.39 X9.5 | v50,41 51.75,42.75 52.25,42.75 v65.5,56 | v71.25,68.5 71,68.25 67.75,68.25 67.5,68 67.5,62.25 67.25,62 v65.5,62
  Bottom 0.35: X9.5 47.68,32.93 48.25,33.5 48.75,33.5 49.5,34.25 49.5,40.5 v50,41 | A2.21 68.91,79.59 70.25,78.25 70.25,76.5 71.25,75.5 v71.25,68.5 | v65.5,56 v65.5,62
MOT4_A  (via drill 0.4)
  Top 0.35: D6.6 59.63,21.64 60,22 R25.1 60.52,23.27 61,23.75 61,27 60.25,27.75 59.75,27.75 v57,30.5 | v57,39 57,40 72.5,55.5 v73.25,55.5
  Bottom 0.35: v57,30.5 v57,39 | v73.25,55.5 73.5,55.5 73.75,55.75 73.75,59.75 74.5,60.5 74.5,81 69.5,86 68.25,86 67.5,85.25 67.5,83.39 A2.22
MOT4_B  (via drill 0.4)
  Top 0.35: D6.7 58.37,21.73 58,22.1 R26.1 57.23,23.27 56.75,23.75 56.75,29.5 v56,30.25 | v56,39.25 56,39.75 v73,56.75
  Bottom 0.35: v56,30.25 v56,39.25 | v73,56.75 73,59.75 73.75,60.5 73.75,79.68 A2.23
MOT4_C  (via drill 0.4)
  Top 0.35: D7.6 65.64,21.71 65,22.35 R27.1 66.03,23.27 66.25,23.5 66.25,26 64.25,28 62,28 v59,31 | v59,40 59,40.25 72.25,53.5 v73.5,53.5
  Bottom 0.35: v59,31 v59,40 | v73.5,53.5 75.25,55.25 75.25,59.75 76,60.5 76,81.5 71,86.5 71,89.25 70.25,90 70.25,90.5 69.75,91 67.75,91 67.5,90.75 67.5,88.47 A2.24
MOT4_D  (via drill 0.4)
  Top 0.35: D7.7 64.36,21.59 63.75,22.2 63.2,22.2 63,22.4 R28.1 61.98,23.27 | 61.98,23.27 61.75,23.5 61.75,27.25 59.25,29.75 59,29.75 v58,30.75 | v58,39.5 58,40.25 72.25,54.5 v73,54.5 | X8.2 77.62,10.18 77.1,10.7 77.1,15.5 v76.6,16 | v61.7,22.4 61.7,23 61.98,23.27
  Bottom 0.35: v58,30.75 v58,39.5 | v73,54.5 73.5,54.5 74.5,55.5 74.5,59.75 75.25,60.5 75.25,81.25 70.25,86.25 70.25,88.26 A2.25 | v76.6,16 72.8,16 66.4,22.4 v61.7,22.4
N$1
  Top 1: X6.8 11.13,30.22 OK3.2 14.18,31.58 14.8,32.2 14.8,37.8 | 14.8,37.8 14.8,43 14,43.8 OK1.2 | OK2.2 14.69,37.69 14.8,37.8
N$2
  Top 0.35: X10.2 96,54.95 94,54.95 93.6,54.55 C1.2 89.95,54.5 88.1,54.5 86.9,55.7 86.9,58.3 | N1.9 86.75,58.7 86.9,58.55 86.9,58.3 | N1.8 86.65,58.05 86.9,58.3
N$3
  Top 0.4: X4.1 48,6.8 45.4,9.4 45.4,11.16 X1.1 45.4,11.3 45.4,13.4 45,13.8 43.4,13.8 43.09,14.11 D3.1
N$4
  Top 0.4: X4.2 50.54,7.06 48,9.6 48,11.2 X1.2 48,11.26 48,13.4 47.6,13.8 47.2,13.8 46.91,14.1 D3.4
N$5
  Top 0.4: X4.3 53.08,6.92 50.6,9.4 50.6,11.1 X1.3 50.4,11.3 50.4,13.2 49.8,13.8 49.4,13.8 49.09,14.11 D5.1
N$6
  Top 0.4: X4.4 55.62,6.78 53,9.4 53,11.2 X1.4 52.91,11.29 D5.4
N$7
  Top 0.4: X4.5 58.16,6.36 61.4,9.6 61.4,11.11 X3.1 61.4,11.35 61.4,12.4 60,13.8 57.4,13.8 57.09,14.11 D6.1
N$8
  Top 0.4: X6.7 6.36,32.76 7,33.4 7,33.8 7.2,34 R6.1
N$9
  Top 0.4: D4.4 38.91,8.49 39,8.4 42.6,8.4 43.8,7.2 43.8,4.02 X2.8
N$10
  Top 0.4: X4.6 60.7,6.3 64,9.6 64,11.21 X3.2 64,11.25 64,12.4 62.6,13.8 61.4,13.8 60.91,14.29 D6.4
N$11
  Top 0.4: D4.1 35.09,8.3 35.8,7.6 40.4,7.6 41.2,6.8 41.2,4.04 X2.7
N$12
  Top 0.4: D2.4 32.91,7.5 33.8,6.6 38.2,6.6 38.8,6 38.8,4.1 X2.6
N$13
  Top 0.4: D2.1 29.09,8.3 30.2,7.2 31.8,7.2 33.4,5.6 35.6,5.6 36.2,5 36.2,4.04 X2.5
N$14
  Top 0.4: X4.7 63.24,6.04 66.6,9.4 66.6,11.15 X3.3 66.4,11.35 66.4,13.2 65.8,13.8 64,13.8 63.09,14.71 D7.1
N$15
  Top 0.4: X4.8 65.78,6.18 69,9.4 69,11.21 X3.4 68.8,11.45 68.8,13.4 68.4,13.8 67.6,13.8 66.91,14.49 D7.4
N$16
  Top 0.4: 65.38,36.89 D8.4
  Top 0.5: K2.K2 65.38,36.89
N$17
  Top 0.4: R29.2 84.53,80.42 85.9,81.8 89.07,81.8 A1.10
N$18
  Top 0.4: 67,33 65.46,33 D8.1
  Top 0.5: K1.K2 72.8,19.8 71.4,19.8 68,23.2 68,32 67,33
N$24
  Top 1: X7.8 10.46,8.22 OK6.2 14.05,10.25 14.8,11 14.8,16.2 | 14.8,16.2 14.8,22 14.4,22.4 12.56,22.4 OK4.2 | OK5.2 14.64,16.36 14.8,16.2
N$25
  Top 0.35: A1.3 73.09,89.19 72.8,88.9 72,88.9 70.9,87.8 70.9,75.28 R2.1
N$26
  Top 0.35: OK6.4 23.29,12.79 23.8,13.3 24.98,13.3 R10.1 25.38,13.28 26.4,14.3 26.4,15.85 26,16.25 26,21.25 26.25,21.5 27.6,21.5 29.7,23.6 29.7,39.6 30.2,40.1 D10.17
N$27
  Top 0.35: OK5.4 23.7,18.9 24,19.2 24.93,19.2 R11.1 | D10.16 29.75,40.75 29,40 29,23.9 27.3,22.2 25.7,22.2 25,21.5 R11.1 | 25.05,19.27 R11.1
N$28
  Top 0.35: X10.1 95.98,52.35 94.55,52.35 93.85,53.05 C1.1 88.45,53.05 87.25,54.25 86.25,54.25 | N1.5 83.9,54.65 84.3,54.25 86.25,54.25 | N1.7 85.8,57.4 86.2,57 86.2,54.3 86.25,54.25
N$29
  Top 0.35: OK4.4 23.71,25.01 24,25.3 24.98,25.3 R12.1 27.57,25.27 28.3,26 28.3,40.6 29.1,41.4 D10.15
N$30
  Top 0.35: N1.4 83.25,53.85 | 83.25,53.85 83.25,53.38 R1.1 | N1.3 82.6,54.5 83.25,53.85
N$31
  Top 0.35: N1.1 81.3,53.95 | 81.3,53.95 81.3,52.92 R1.2 | N1.2 81.95,54.6 81.3,53.95
N$32
  Top 0.35: OK3.4 24.84,34.12 R13.1 24.95,34.27 26.98,34.27 27.6,34.9 27.6,40.9 28.85,42.05 D10.14
N$33
  Top 0.35: OK2.4 24.95,40.23 R14.1 26.68,40.27 26.9,40.5 26.9,41.2 28.4,42.7 D10.13
N$34
  Top 0.35: D10.12 29.45,43.35 26.5,46.3 25.02,46.3 R15.1 24.85,46.27 22.09,46.27 OK1.4
N$35
  Top 0.4: X6.5 6.24,37.84 7,38.6 7,39.4 7.6,40 R7.1
N$36
  Top 0.4: R8.2 12.15,46 OK1.1
N$37
  Top 0.4: R7.2 12.26,40 OK2.1
N$38
  Top 0.4: R6.2 12.37,34 OK3.1
N$39
  Top 0.4: R5.2 OK4.1
N$40
  Top 0.4: R4.2 12.39,19 OK5.1
N$41
  Top 0.4: R3.2 12.28,13 OK6.1
N$42
  Top 0.4: X6.3 6.32,42.92 7,43.6 7,45.4 7.6,46 R8.1
N$43
  Top 0.55: C18.1 30.5,74.55 30.65,74.7
  Top 1: D9.C 33.2,73.4 30.2,73.4 30.23,73.38 N3.8 30.65,74.7 30.65,75.36 L2.1
N$44
  Top 0.4: X7.7 5.96,10.76 7,11.8 7,12.4 7.6,13 R3.1
N$45
  Top 0.4: X7.5 6.04,15.84 7,16.8 7,18.4 7.6,19 R4.1
N$46
  Top 1: X6.1 3,48 2,47 2,45.6 | 2,45.6 2,40.4 | 2,40.4 2,36.2 2.8,35.4 3.9,35.4 X6.6 | X6.4 2.02,40.38 2,40.4 | X6.2 2.14,45.46 2,45.6
N$47
  Top 0.4: X7.3 6.12,20.92 7,21.8 7,24.4 7.6,25 R5.1
N$48
  Top 1: X7.1 2.6,26 1.8,25.2 1.8,23.6 | 1.8,23.6 1.8,18.6 | 1.8,18.6 1.8,14.2 2.6,13.4 3.9,13.4 X7.6 | X7.4 2.02,18.38 1.8,18.6 | X7.2 1.94,23.46 1.8,23.6
N$50
  Top 0.7: A2.28 67.03,99.1 51,99.1 50.8,98.9 50.8,95.4 49.1,93.7 44.8,93.7 43.2,95.3 43.2,96.9 41.4,98.7 28.6,98.7 26.98,97.08 27,97.06 27,94.75 25.83,93.58 D1.C
N$55
  Top 0.25: A1.12 91.72,85.78 93.75,83.75 95.88,83.75 X11.4
N$56
  Top 0.25: A1.11 91.22,83.78 93.75,81.25 95.84,81.25 X11.5
N$58
  Top 0.55: N3.1 23.88,73.38 23.2,72.7 22.05,72.7 C18.2
N$60
  Top 0.55: N3.4 25.25,68 C19.1 | C19.1 25.15,66.33 R39.2 25.18,64.72 C20.1 | R38.1 C19.1
N$62
  Top 0.55: C20.2 27.8,64.7 28.3,65.2 R40.2
N$72
  Top 0.35: A2.34 62.34,88.55 C26.1 47.58,88.53 R42.2 R41.1 44.1,89.7 44.6,90.2 44.6,91 V1.3
N$73
  Top 0.35: V1.2 50.45,92.05 52,93.6 55.6,93.6 56.91,92.29 A2.26
RELAY1
  Top 0.35: D8.6 58.91,35.63 58.55,36 R9.1 57.73,36.77 57.5,37 53.2,37 52,35.8 37.7,35.8 34.05,39.45 D10.18
RELAY2
  Top 0.35: D8.7 58.97,34.37 58.6,34 R16.1 57.7,34.02 57.7,33.1 57.6,33 55.4,33 53.3,35.1 37.3,35.1 33.6,38.8 D10.19
RLY1COM
  Top 1: K1.COM 89.8,25.8 92.4,28.4 95.97,28.4 X5.2 X5.3
RLY1NC
  Top 1: K1.NC 89.91,19.8 X5.1
RLY1NO
  Top 1: K1.NO 87.8,31.8 89.75,33.75 95.87,33.75 X5.4
RLY2COM
  Top 1: K2.COM 72.19,42.8 87,42.8 88.56,41.24 X5.7 X5.6
RLY2NC
  Top 1: K2.NC 88.61,36.89 89.25,36.25 95.91,36.25 X5.5
RLY2NO
  Top 1: X5.8 91.41,43.78 K2.NO
SCLK  (via drill 0.4)
  Top 0.35: N1.12 83.25,61.95 82.5,62.7 74,62.7 v72.7,61.4 73,61.7 | D10.1 52.85,38.15 v71.8,57.1
  Bottom 0.35: v72.7,61.4 71.9,61.4 | 71.9,61.4 71.71,61.4 A2.15 | v71.8,57.1 71.8,61.3 71.9,61.4
SHUTDOWN~  (via drill 0.4)
  Top 0.4: N3.5 30.65,68.4 v30.5,68.25 | v29.25,65.5 29.25,65 28,63.75 v13.5,63.75
  Bottom 0.4: v30.5,68.25 30.5,66.75 v29.25,65.5 | v13.5,63.75 9.41,63.75 X16.3
TEMP_CS~
  Top 0.35: A2.12 53.52,69.02 51,66.5 51,62.5 53.6,59.9 72.7,59.9 74.9,62.1 82.1,62.1 82.6,61.6 N1.13
TEMP_DRDY~  (via drill 0.4)
  Top 0.35: N1.18 78.95,58.05 v78.6,58.4 | v78.6,64.2 71.45,64.2 A2.16
  Bottom 0.35: v78.6,58.4 v78.6,64.2

### Text on the board
tPlace: BAT+ | BAT- | KIMMOLI 2015 | Twitter @IoBBQ
bPlace: TX | RX | RST | GP0 | BARBEQUE / CONTROLLER | GP2 | +3V3 | GND | P4 | +5V | P5 | P3 | GND | P6 | +3V3 | SHUTDOWN | GND | PT100 | PT100 | CPOS | CPOS | R2NO | IN1 | R2COM | CPOS | IN2 | R2COM | R2NC | CPOS | R1NO | IN3 | R1COM | CGND | R1COM | DPOS | R1NC | DPOS | IN4 | DPOS | IN5 | DPOS | IN6 | DGND | +5V | GND | +5V | GND | MOT1 | MOT1 | MOT2 | MOT2 | MOT3 | MOT3 | MOT3 | MOT3 | MOT4 | MOT4 | MOT4 | MOT4